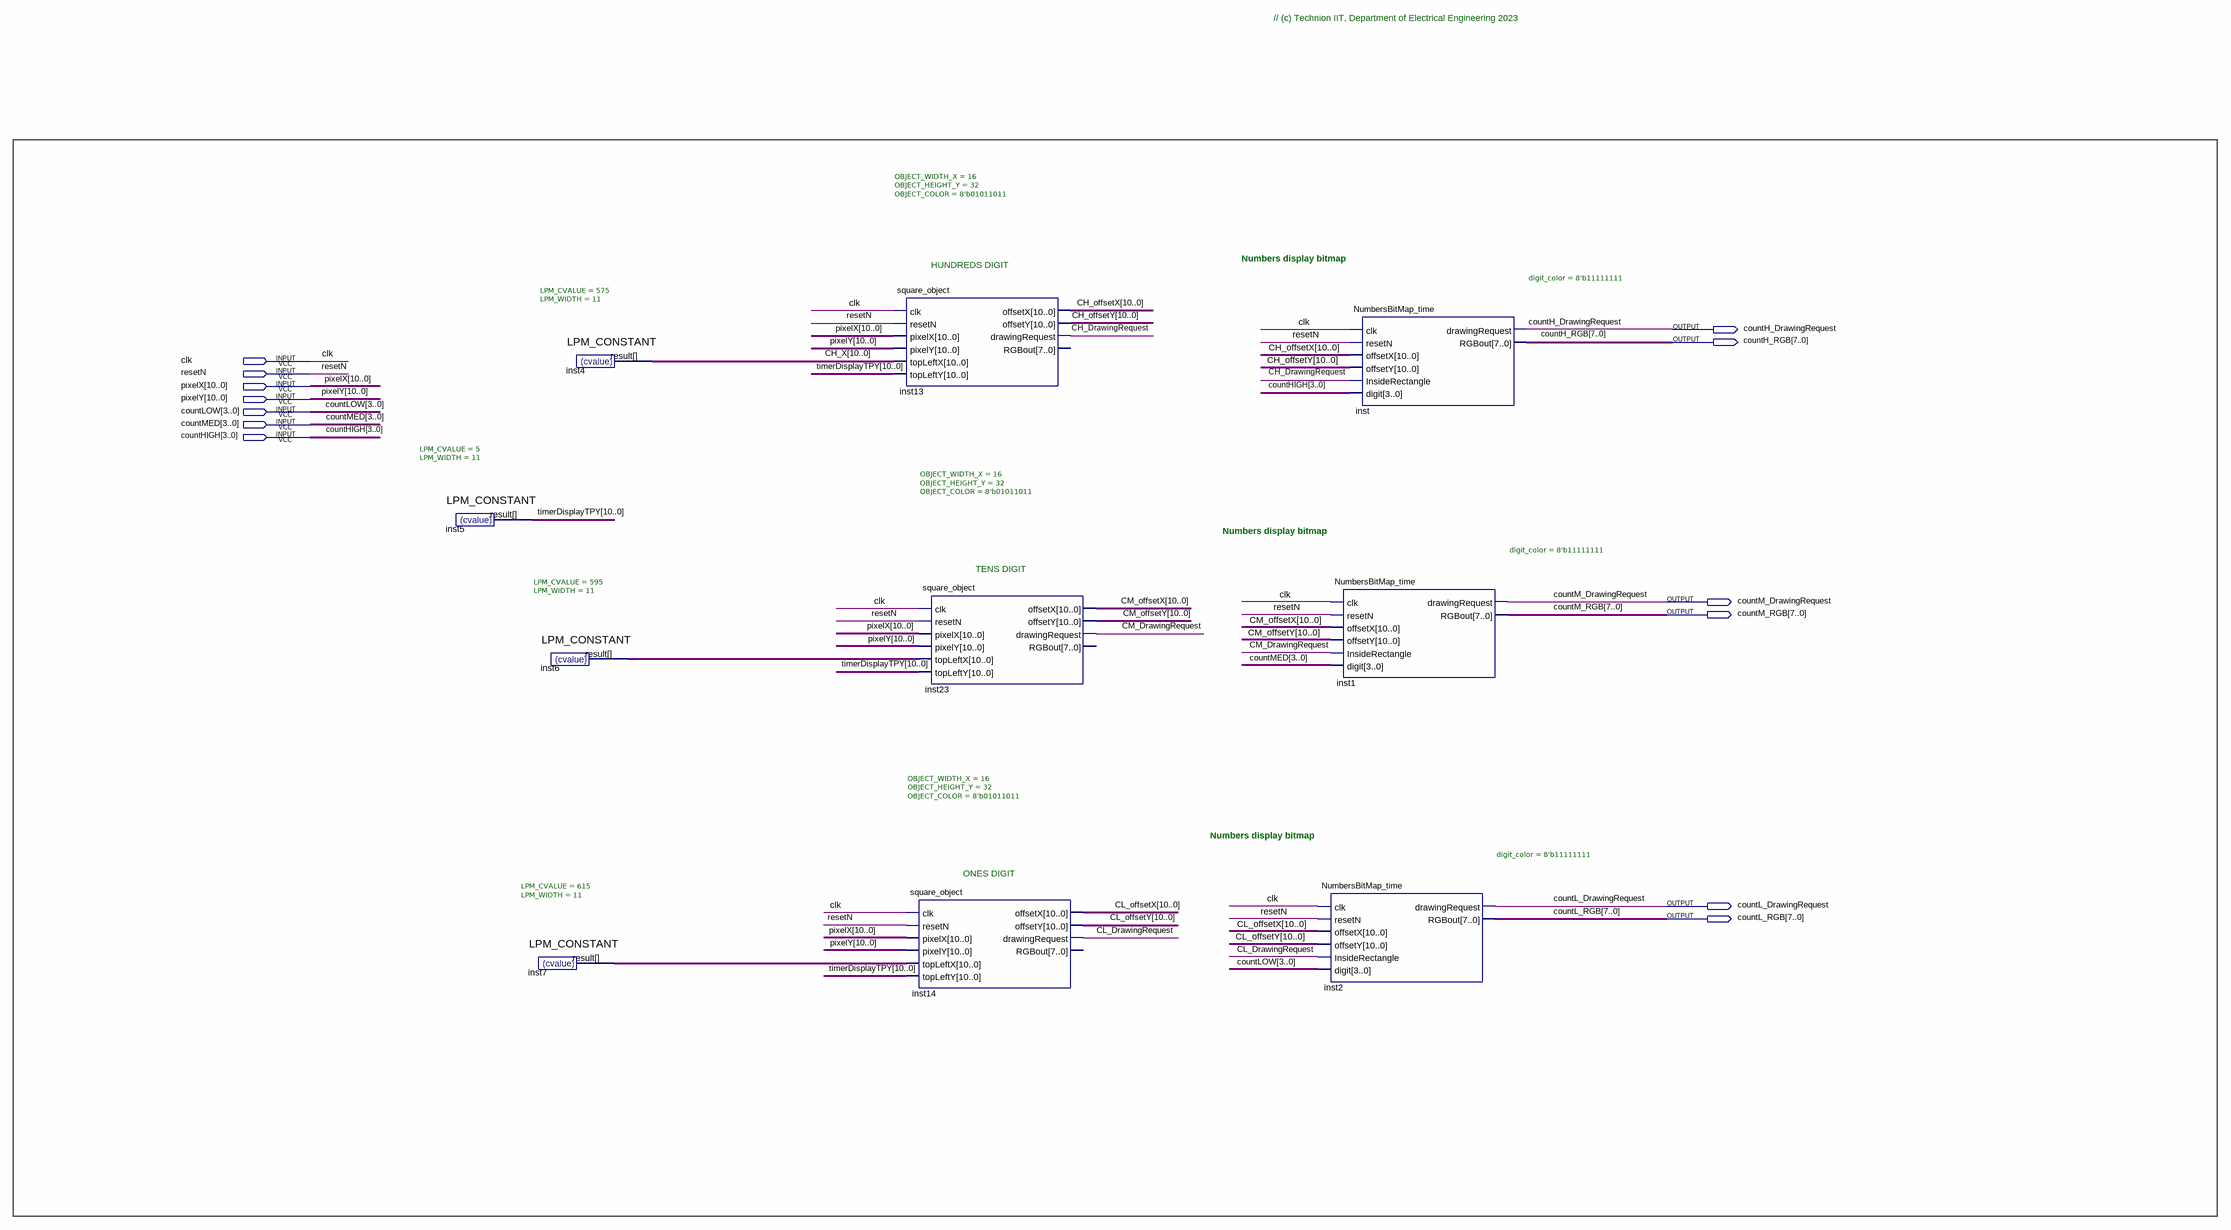
[diagram p0: schematic sheet]
// Quartus schematic TIMER_DISPLAY.bdf as structural Verilog: 10 symbols, 13 pins
module TIMER_DISPLAY (
  input  clk,
  input  resetN,
  input  [10:0] pixelX,
  input  [10:0] pixelY,
  input  [3:0] countLOW,
  input  [3:0] countMED,
  input  [3:0] countHIGH,
  output countH_DrawingRequest,
  output [7:0] countH_RGB,
  output countM_DrawingRequest,
  output [7:0] countM_RGB,
  output countL_DrawingRequest,
  output [7:0] countL_RGB
);

  wire CH_DrawingRequest, CL_DrawingRequest, CM_DrawingRequest;
  wire [10:0] CH_offsetX, CH_offsetY, CH_X, CL_offsetX, CL_offsetY, CM_offsetX, CM_offsetY, inst6_result,
       inst7_result, timerDisplayTPY;

  LPM_CONSTANT #(.LPM_CVALUE(5), .LPM_WIDTH(11)) inst5 (.result(timerDisplayTPY));
  LPM_CONSTANT #(.LPM_CVALUE(575), .LPM_WIDTH(11)) inst4 (.result(CH_X));
  LPM_CONSTANT #(.LPM_CVALUE(595), .LPM_WIDTH(11)) inst6 (.result(inst6_result));
  LPM_CONSTANT #(.LPM_CVALUE(615), .LPM_WIDTH(11)) inst7 (.result(inst7_result));
  square_object #(.OBJECT_WIDTH_X(16), .OBJECT_HEIGHT_Y(32), .OBJECT_COLOR(8'b01011011)) inst13 (
    .clk(clk), .resetN(resetN), .pixelX(pixelX), .pixelY(pixelY), .topLeftX(CH_X),
    .topLeftY(timerDisplayTPY), .offsetX(CH_offsetX), .offsetY(CH_offsetY), .drawingRequest(CH_DrawingRequest));  // open: RGBout
  square_object #(.OBJECT_WIDTH_X(16), .OBJECT_HEIGHT_Y(32), .OBJECT_COLOR(8'b01011011)) inst23 (
    .clk(clk), .resetN(resetN), .pixelX(pixelX), .pixelY(pixelY), .topLeftX(inst6_result),
    .topLeftY(timerDisplayTPY), .offsetX(CM_offsetX), .offsetY(CM_offsetY), .drawingRequest(CM_DrawingRequest));  // open: RGBout
  square_object #(.OBJECT_WIDTH_X(16), .OBJECT_HEIGHT_Y(32), .OBJECT_COLOR(8'b01011011)) inst14 (
    .clk(clk), .resetN(resetN), .pixelX(pixelX), .pixelY(pixelY), .topLeftX(inst7_result),
    .topLeftY(timerDisplayTPY), .offsetX(CL_offsetX), .offsetY(CL_offsetY), .drawingRequest(CL_DrawingRequest));  // open: RGBout
  NumbersBitMap_time #(.digit_color(8'b11111111)) inst2 (
    .clk(clk), .resetN(resetN), .offsetX(CL_offsetX), .offsetY(CL_offsetY),
    .InsideRectangle(CL_DrawingRequest), .digit(countLOW), .drawingRequest(countL_DrawingRequest),
    .RGBout(countL_RGB));
  NumbersBitMap_time #(.digit_color(8'b11111111)) inst (
    .clk(clk), .resetN(resetN), .offsetX(CH_offsetX), .offsetY(CH_offsetY),
    .InsideRectangle(CH_DrawingRequest), .digit(countHIGH), .drawingRequest(countH_DrawingRequest),
    .RGBout(countH_RGB));
  NumbersBitMap_time #(.digit_color(8'b11111111)) inst1 (
    .clk(clk), .resetN(resetN), .offsetX(CM_offsetX), .offsetY(CM_offsetY),
    .InsideRectangle(CM_DrawingRequest), .digit(countMED), .drawingRequest(countM_DrawingRequest),
    .RGBout(countM_RGB));

  // Notes on the sheet:
  //   // (c) Technion IIT, Department of Electrical Engineering 2023
  //   Numbers display bitmap
  //   HUNDREDS DIGIT
  //   Numbers display bitmap
  //   TENS DIGIT
  //   Numbers display bitmap
  //   ONES DIGIT
endmodule
